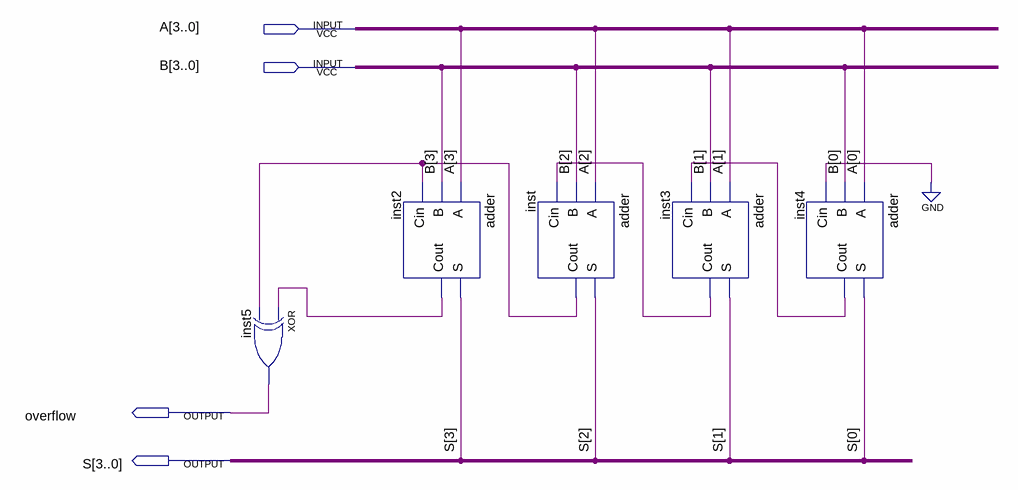
[diagram p0: schematic sheet]
// Quartus schematic fulladder.bdf as structural Verilog: 5 symbols, 4 pins
module fulladder (
  input  [3:0] A,
  input  [3:0] B,
  output overflow,
  output [3:0] S
);

  wire inst2_cout, inst3_cout, inst4_cout, inst_cout;

  xor inst5 (overflow, inst2_cout, inst_cout);
  adder inst2 (.A(A[3]), .B(B[3]), .Cin(inst_cout), .S(S[3]), .Cout(inst2_cout));
  adder inst (.A(A[2]), .B(B[2]), .Cin(inst3_cout), .S(S[2]), .Cout(inst_cout));
  adder inst3 (.A(A[1]), .B(B[1]), .Cin(inst4_cout), .S(S[1]), .Cout(inst3_cout));
  adder inst4 (.A(A[0]), .B(B[0]), .Cin(1'b0), .S(S[0]), .Cout(inst4_cout));
endmodule
